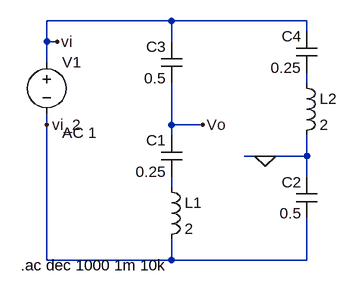
[diagram p0: schematic lattice_asc-checkpoint.asc]
lattice_asc-checkpoint.asc, the LTspice schematic file:
Version 4
SHEET 1 880 680
WIRE 16 32 -176 32
WIRE 224 32 16 32
WIRE 224 48 224 32
WIRE -176 64 -176 32
WIRE -160 64 -176 64
WIRE 16 64 16 32
WIRE -176 96 -176 64
WIRE 224 128 224 112
WIRE -176 192 -176 176
WIRE 16 192 16 128
WIRE 64 192 16 192
WIRE 16 208 16 192
WIRE 160 240 128 240
WIRE 224 240 224 208
WIRE 224 240 160 240
WIRE 224 272 224 240
WIRE 16 288 16 272
WIRE -176 400 -176 192
WIRE 16 400 16 368
WIRE 16 400 -176 400
WIRE 224 400 224 336
WIRE 224 400 16 400
FLAG -160 64 vi
FLAG -176 192 vi_2
FLAG 160 240 0
FLAG 64 192 Vo
SYMBOL voltage -176 80 R0
WINDOW 123 24 124 Left 2
WINDOW 39 0 0 Left 0
SYMATTR Value2 AC 1
SYMATTR InstName V1
SYMATTR Value ""
SYMBOL cap 32 272 R180
WINDOW 0 24 56 Left 2
WINDOW 3 24 8 Left 2
SYMATTR InstName C1
SYMATTR Value 0.25
SYMBOL cap 240 336 R180
WINDOW 0 24 56 Left 2
WINDOW 3 24 8 Left 2
SYMATTR InstName C2
SYMATTR Value 0.5
SYMBOL cap 32 128 R180
WINDOW 0 24 56 Left 2
WINDOW 3 24 8 Left 2
SYMATTR InstName C3
SYMATTR Value 0.5
SYMBOL cap 240 112 R180
WINDOW 0 24 56 Left 2
WINDOW 3 24 8 Left 2
SYMATTR InstName C4
SYMATTR Value 0.25
SYMBOL ind 0 272 R0
SYMATTR InstName L1
SYMATTR Value 2
SYMBOL ind 208 112 R0
SYMATTR InstName L2
SYMATTR Value 2
TEXT -216 408 Left 2 !.ac dec 1000 1m 10k

The netlist it stands for:
* lattice_asc-checkpoint.asc
V1 vi vi_2 AC 1
C1 N002 Vo 0.25
C2 vi_2 0 0.5
C3 Vo vi 0.5
C4 N001 vi 0.25
L1 N002 vi_2 2
L2 N001 0 2
.ac dec 1000 1m 10k
.backanno
.end